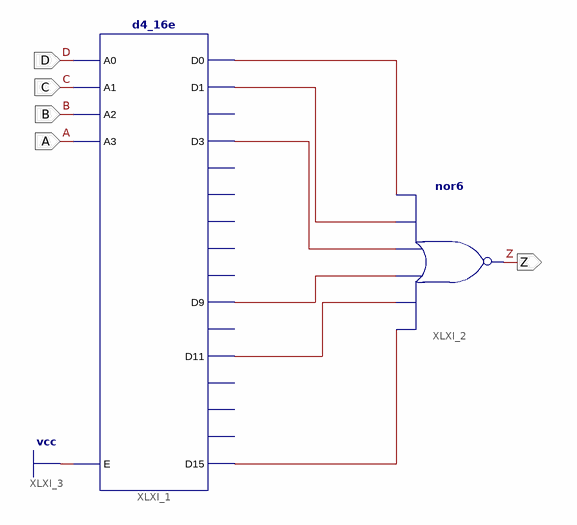
[diagram p0: schematic sheet 1]
// Xilinx ISE schematic ExamenP2_v1.sch (spartan3) as structural Verilog: 2 symbols, 5 ports
module ExamenP2_v1 (
  input  A,
  input  B,
  input  C,
  input  D,
  output Z
);

  wire XLXN_6, XLXN_7, XLXN_8, XLXN_9, XLXN_10, XLXN_11;

  d4_16e XLXI_1 (
    .A0(D), .A1(C), .A2(B), .A3(A), .E(1'b1), .D0(XLXN_6), .D1(XLXN_7), .D11(XLXN_10), .D15(XLXN_11),
    .D3(XLXN_8), .D9(XLXN_9));  // open: D10, D12, D13, D14, D2, D4, D5, D6, D7, D8
  nor XLXI_2 (Z, XLXN_11, XLXN_10, XLXN_9, XLXN_8, XLXN_7, XLXN_6);
endmodule
